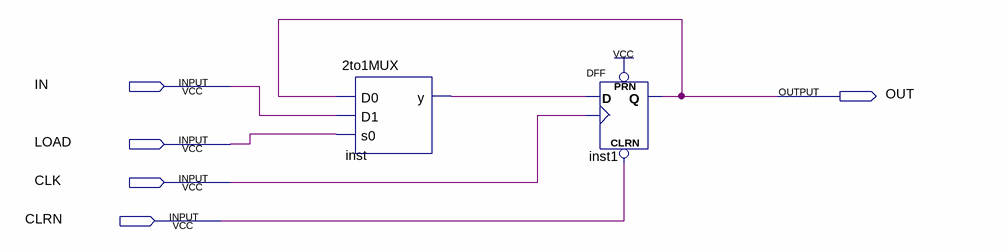
[diagram p0: schematic sheet]
// Quartus schematic 1bitReg.bdf as structural Verilog: 2 symbols, 5 pins
module \1bitReg  (
  input  IN,
  input  LOAD,
  input  CLK,
  input  CLRN,
  output OUT
);

  wire inst_y;

  \2to1MUX  inst (.D0(OUT), .D1(IN), .s0(LOAD), .y(inst_y));
  DFF inst1 (.CLRN(CLRN), .CLK(CLK), .D(inst_y), .PRN(1'b1), .Q(OUT));
endmodule
